# EAGLE design EEZ DIB AUX PS r1B2 (EAGLE 7.2.0)
Assembly variants: Farnell, TME

## Sheet 1 of 2: Power board tester
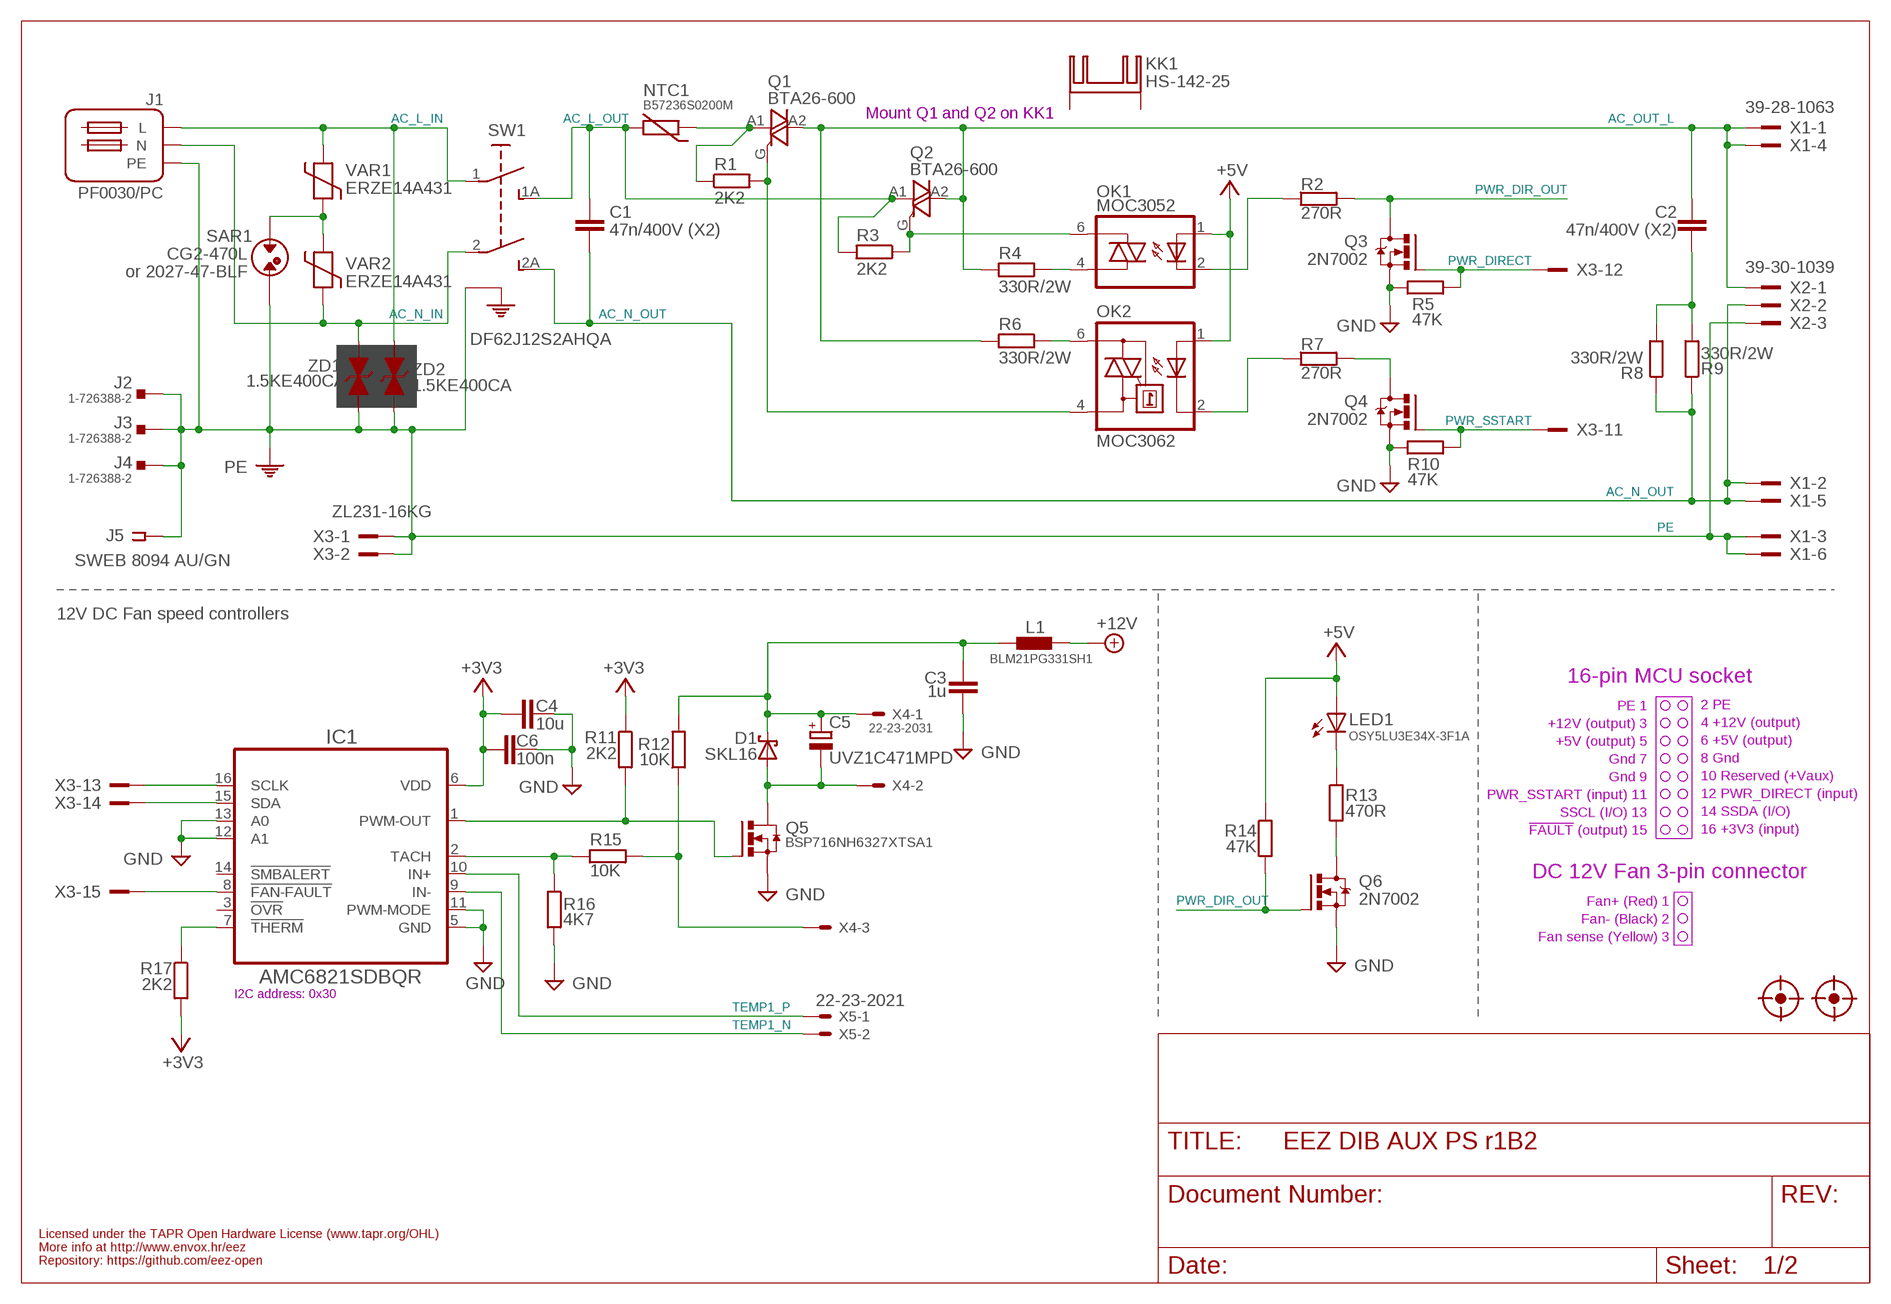
[diagram p0: schematic, sheet 1]

### Parts
C1  47n/400V (X2)  C-EU102-054X133  [C102-054X133]
C2  47n/400V (X2)  C-EU102-054X133  [C102-054X133]
C3  1u  C-EUC0805  [C0805]
C4  10u  C-EUC1206  [C1206]
C5  UVZ1C471MPD  ECAP3.5G_8MM  [ECAP3.5/8]
C6  100n  C-EUC0603  [C0603]
D1  SKL16  SCHOTTKYSOD123  [SOD123]
FM1  FIDUCIAL  [FIDUCIAL]
FM2  FIDUCIAL  [FIDUCIAL]
IC1  AMC6821SDBQR  AMC6821  [DBQ16]
J1  PF0030/PC  [PF0030/PC]
J2  1-726388-2  PCB_TAB4.8MM  [PCB_TAB-4.8MM]
J3  1-726388-2  PCB_TAB4.8MM  [PCB_TAB-4.8MM]
J4  1-726388-2  PCB_TAB4.8MM  [PCB_TAB-4.8MM]
J5  SWEB 8094 AU/GN  BINDING_POSTCLIFF  [S16N-PC]
KK1  HS-142-25  SK129-PAD  [SK129]
L1  BLM21PG331SH1  L-EU0805  [0805]
LED1  OSY5LU3E34X-3F1A  LEDOSG8  [OSG8]
NTC1  B57236S0200M  NTC11.5X6  [NTC_11.5X6_RM5]
OK1  MOC3052  MOC305X  [DIL6-SMD]
OK2  MOC3062  MOC3033S  [DIL6-SMD]
Q1  BTA26-600  BTA26-V  [TOP3S-1]
Q2  BTA26-600  BTA26-V  [TOP3S-1]
Q3  2N7002  [SOT103P240X110-3N]
Q4  2N7002  [SOT103P240X110-3N]
Q5  BSP716NH6327XTSA1  N-HEXFET-2D_SOT232-IRLL014N  [SOT223]
Q6  2N7002  [SOT103P240X110-3N]
R1  2K2  R-EU_R0805  [R0805]
R2  270R  R-EU_R0805  [R0805]
R3  2K2  R-EU_R0805  [R0805]
R4  330R/2W  R-EU_R2512  [R2512]
R5  47K  R-EU_R0805  [R0805]
R6  330R/2W  R-EU_R2512  [R2512]
R7  270R  R-EU_R0805  [R0805]
R8  330R/2W  R-EU_R2512  [R2512]
R9  330R/2W  R-EU_R2512  [R2512]
R10  47K  R-EU_R0805  [R0805]
R11  2K2  R-EU_R0805  [R0805]
R12  10K  R-EU_R0805  [R0805]
R13  470R  R-EU_R0805  [R0805]
R14  47K  R-EU_R0805  [R0805]
R15  10K  R-EU_R0805  [R0805]
R16  4K7  R-EU_R0805  [R0805]
R17  2K2  R-EU_R0805  [R0805]
SAR1  CG2-470L  SAR  [SAR]
SW1  DF62J12S2AHQA  [DF62J12S2]
VAR1  ERZE14A431  VARISTOR-13  [VARISTOR_13MM]
VAR2  ERZE14A431  VARISTOR-13  [VARISTOR_13MM]
X1  39-28-1063  MINIFIT_5566-06A-CRE  [MINIFIT_5566-06A_CRE]
X2  39-30-1039  MINIFIT_39301039-CREEPAGE  [MINIFIT_39301039_CRE]
X3  ZL231-16KG  IDC-16PIN-ANGLED  [ML16L]
X4  22-23-2031  [22-23-2031]
X5  22-23-2021  [22-23-2021]
ZD1  1.5KE400CA  1.5KE-BIDIR  [DO201-BIDIR]
ZD2  1.5KE400CA  1.5KE-BIDIR  [DO201-BIDIR]

### Nets
+3V3: C4.2 C6.2 IC1.6(VDD) R11.1 R17.2 ; also sheet 2
+5V: LED1.A OK1.1(A) OK2.1(A) R14.1 ; also sheet 2
+12V: L1.2 ; also sheet 2
+12V_FAN: C3.1 C5.+ D1.C L1.1 R12.2 X4.1
AC_L_IN: J1.L SW1.1(P) VAR1.2 ZD2.A
AC_L_OUT: C1.1 NTC1.1 Q2.A1 R3.2 SW1.1A(S) ; also sheet 2
AC_N_IN: J1.N SW1.2(P1) VAR2.1 ZD1.A
AC_N_OUT: C1.2 R8.1 R9.1 SW1.2A(S1) X1.2 X1.5 X2.2 ; also sheet 2
AC_OUT_L: C2.1 Q1.A2 Q2.A2 R4.2 R6.2 X1.1 X1.4 X2.1
FAN_OUT: C5.- D1.A Q5.2(D) Q5.4(D) X4.2
FAN_SENSE: R12.1 R15.2 X4.3
GND [gnd]: C3.2 C4.1 C6.1 IC1.5(GND) IC1.11(PWM-MODE) IC1.12(A1) IC1.13(A0) Q3.2(S) Q4.2(S) Q5.3(S) Q6.2(S) R5.1 R10.1 R16.2 ; also sheet 2
N$1: NTC1.2 Q1.A1 R1.1
N$2: IC1.2(TACH) R15.1 R16.1
N$3: IC1.7(!THERM) R17.1
N$6: SAR1.P$1 VAR1.1 VAR2.2
N$7: OK2.2(C) R7.1
N$10: OK1.2(C) R2.1
N$13: Q6.3(D) R13.2
N$14: LED1.C R13.1
N$16: Q4.3(D) R7.2
N$58: IC1.1(PWM-OUT) Q5.1(G) R11.2
N$71: OK1.6(A2) Q2.G R3.1
N$72: OK2.4(A1) Q1.G R1.2
N$73: OK2.6(A2) R6.1
N$76: OK1.4(A1) R4.1
N$83: C2.2 R8.2 R9.2
NFAULT: IC1.8(!FAN-FAULT) X3.15
PE: J1.PE J2.P$1 J2.P$2 J3.P$1 J3.P$2 J4.P$1 J4.P$2 J5.1 J5.NC1 J5.NC2 J5.NC3 J5.NC4 SAR1.P$2 SW1.PE1(PE) SW1.PE2(PE) X1.3 X1.6 X2.3 X3.1 X3.2 ZD1.C ZD2.C ; also sheet 2
PWR_DIR_OUT: Q3.3(D) Q6.1(G) R2.2 R14.2
PWR_DIRECT: Q3.1(G) R5.2 X3.12
PWR_SSTART: Q4.1(G) R10.2 X3.11
SSCL: IC1.16(SCLK) X3.13
SSDA: IC1.15(SDA) X3.14
TEMP1_N [diff]: IC1.9(IN-) X5.2
TEMP1_P [diff]: IC1.10(IN+) X5.1
Unconnected: IC1.3(!OVR) IC1.14(!SMBALERT) KK1.A2,5(K) KK1.B2,5(K) X3.10

### Notes on the sheet
- Mount Q1 and Q2 on KK1
- or 2027-47-BLF
- 12V DC Fan speed controllers
- 16-pin MCU socket
- PE 1
- 2 PE
- +12V (output) 3
- 4 +12V (output)
- +5V (output) 5
- 6 +5V (output)
- Gnd 7
- 8 Gnd
- Gnd 9
- 10 Reserved (+Vaux)
- PWR_SSTART (input) 11
- 12 PWR_DIRECT (input)
- SSCL (I/O) 13
- 14 SSDA (I/O)
- !FAULT! (output) 15
- 16 +3V3 (input)
- DC 12V Fan 3-pin connector
- Fan+ (Red) 1
- Fan- (Black) 2
- Fan sense (Yellow) 3
- I2C address: 0x30
- Licensed under the TAPR Open Hardware License (www.tapr.org/OHL)
- More info at http://www.envox.hr/eez
- Repository: https://github.com/eez-open

## Sheet 2 of 2
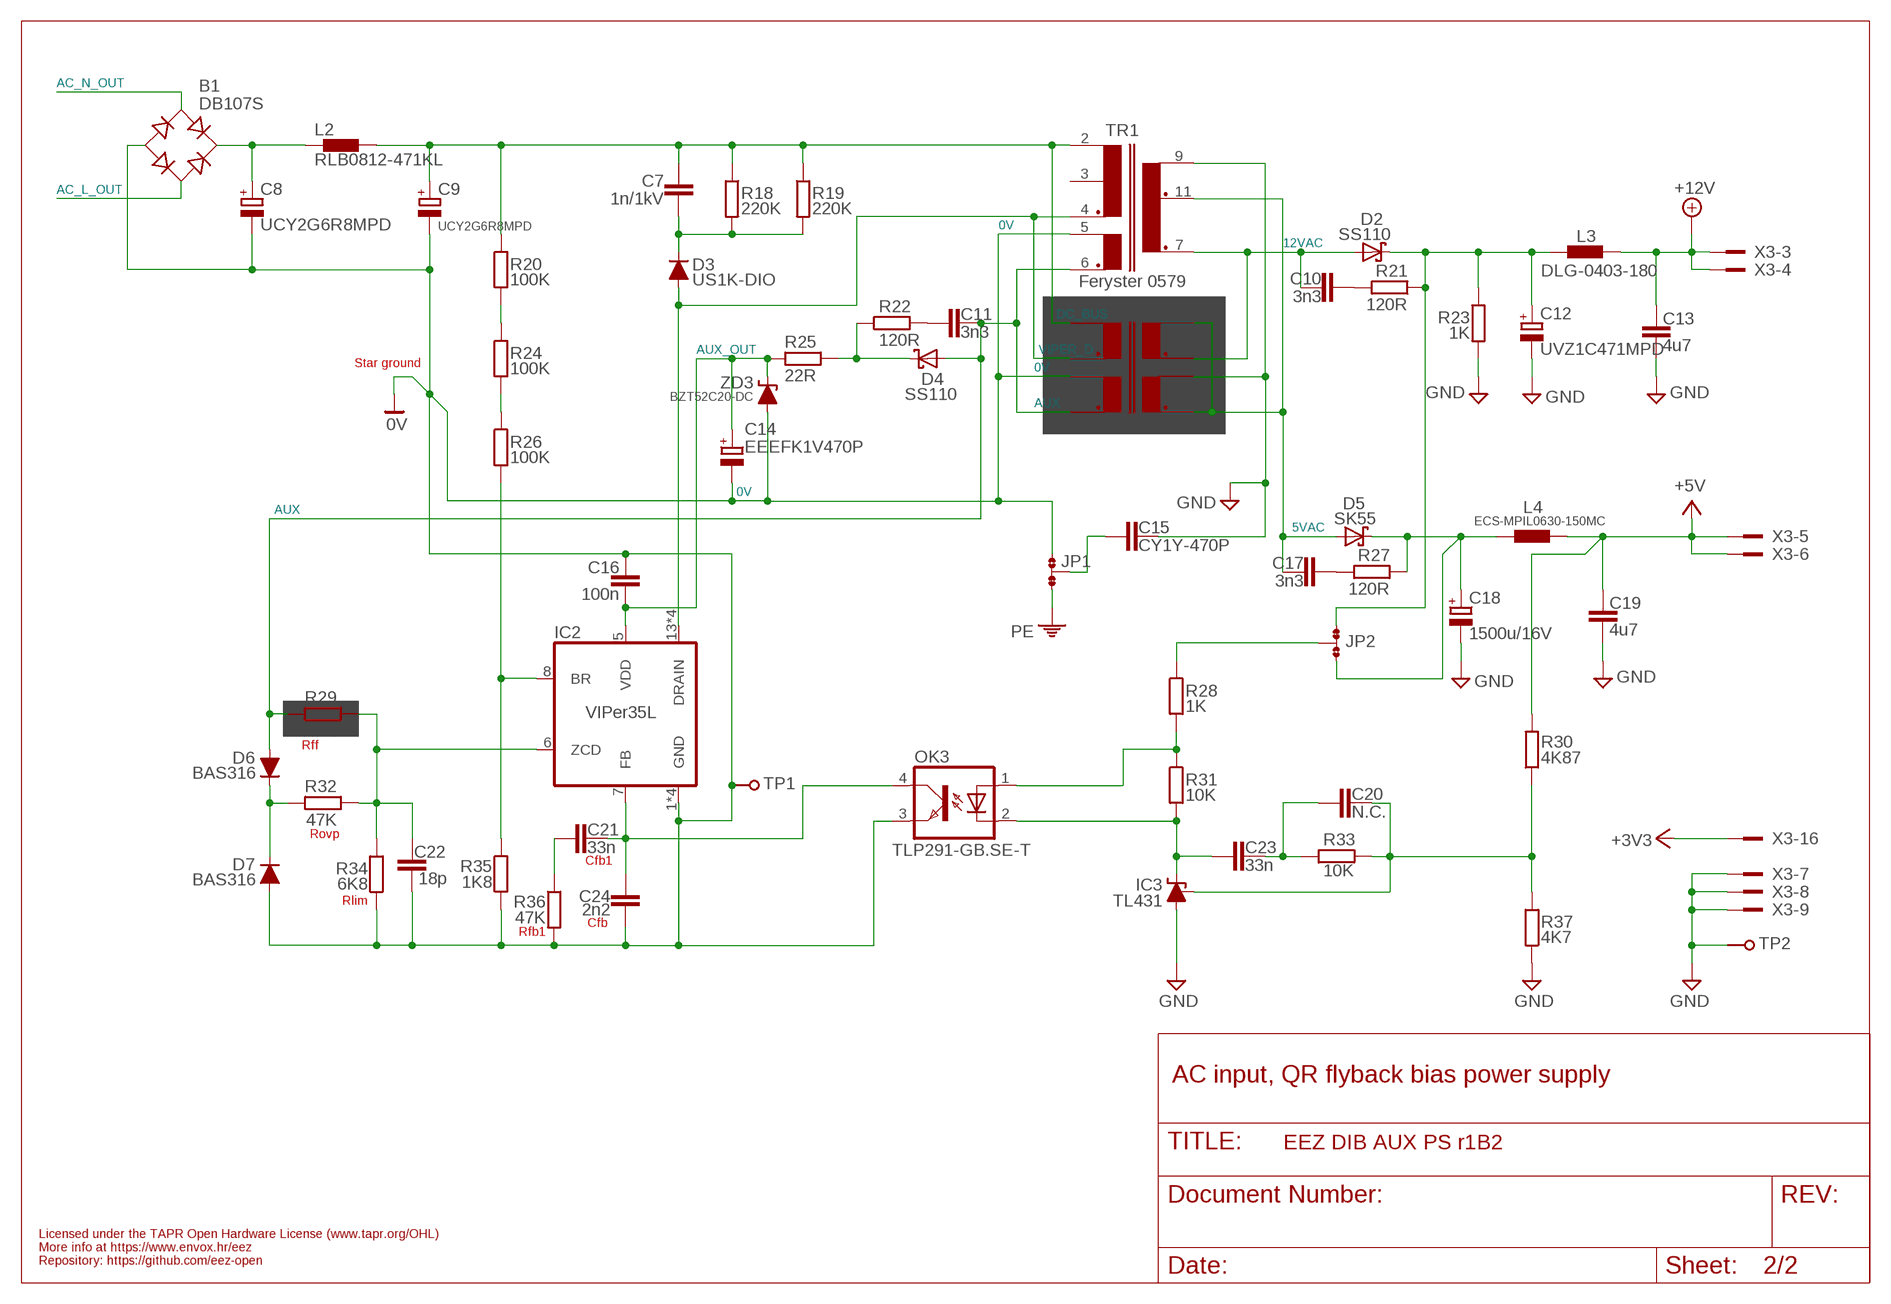
[diagram p1: schematic, sheet 2]

### Parts
B1  DB107S  DBS107G  [DBS]
C7  1n/1kV  C-EUC1210  [C1210]
C8  UCY2G6R8MPD  ECAP5G_10.5MM  [ECAP5/10.5]
C9  UCY2G6R8MPD  ECAP5G_10.5MM  [ECAP5/10.5]
C10  3n3  C-EUC0805  [C0805]
C11  3n3  C-EUC0805  [C0805]
C12  UVZ1C471MPD  ECAP3.5G_8MM  [ECAP3.5/8]
C13  4u7  C-EUC1210  [C1210]
C14  EEEFK1V470P  ECAPPANASONIC_H  [CAPAE660X610N]
C15  CY1Y-470P  C-EUCY  [CY075-032X103]
C16  100n  C-EUC0603  [C0603]
C17  3n3  C-EUC0805  [C0805]
C18  1500u/16V  ECAP5G_13MM  [ECAP5/13]
C19  4u7  C-EUC1210  [C1210]
C20  N.C.  C-EUC0805  [C0805]
C21  33n  C-EUC0805  [C0805]
C22  18p  C-EUC0603  [C0603]
C23  33n  C-EUC0805  [C0805]
C24  2n2  C-EUC0805  [C0805]
D2  SS110  SCHOTTKYSMB  [SMB]
D3  US1K-DIO  DIODEDO214AA  [DO214AA]
D4  SS110  SCHOTTKYSMB  [SMB]
D5  SK55  SCHOTTKYSMB  [SMB]
D6  BAS316  DIODESOD323R  [SOD323-R]
D7  BAS316  DIODESOD323R  [SOD323-R]
IC2  VIPer35L  VIPER35  [SOIC-16]
IC3  TL431  [SOT103P240X110-3N]
JP1  JP3-CUT  [JP3-CUT]
JP2  JP3-CUT  [JP3-CUT]
L2  RLB0812-471KL  FERYSTER_DSZ6  [FERSYTER_DSZ6]
L3  DLG-0403-180  DE0403  [DE0403]
L4  ECS-MPIL0630-150MC  DE0704  [DE0704]
OK3  TLP291-GB.SE-T  TLP291  [SO4]
R18  220K  R-EU_R1206  [R1206]
R19  220K  R-EU_R1206  [R1206]
R20  100K  R-EU_R1206  [R1206]
R21  120R  R-EU_R0805  [R0805]
R22  120R  R-EU_R0805  [R0805]
R23  1K  R-EU_R0805  [R0805]
R24  100K  R-EU_R1206  [R1206]
R25  22R  R-EU_R0805  [R0805]
R26  100K  R-EU_R1206  [R1206]
R27  120R  R-EU_R0805  [R0805]
R28  1K  R-EU_R0805  [R0805]
R29  N.C.  R-EU_R0805  [R0805]
R30  4K87  R-EU_R0805  [R0805]
R31  10K  R-EU_R0805  [R0805]
R32  47K  R-EU_R0805  [R0805]
R33  10K  R-EU_R0805  [R0805]
R34  6K8  R-EU_R0805  [R0805]
R35  1K8  R-EU_R0805  [R0805]
R36  47K  R-EU_R0805  [R0805]
R37  4K7  R-EU_R0805  [R0805]
TP1  PCB_TEST_TABSHIELD  [PCB_SHIELD_TAB]
TP2  PCB_TEST_TABSHIELD  [PCB_SHIELD_TAB]
TR1  Feryster 0579  FERYSTER_0579  [FERYSTER_0579]
TR1B  (WE 760875532)  WE-UOST  [WE-UOST]
ZD3  BZT52C20-DC  ZENER-DIODESOD123  [SOD123]

### Nets
0V: B1.- C8.- C9.- C14.2(-) C16.1 C22.2 C24.2 D7.A IC2.1(GND) IC2.2(GND) IC2.3(GND) IC2.4(GND) JP1.NO OK3.3(EMIT) R34.1 R35.2 R36.2 TP1.1 TR1.5(AUX) TR1B.11(AUX) ZD3.A
5VAC: C17.2 D5.A TR1.11(S1_DOT) TR1B.2(S1) TR1B.3(S2_DOT) TR1B.4(S2_DOT)
12VAC: C10.2 D2.A TR1.7(S2_DOT) TR1B.1(S1_DOT)
+3V3: X3.16 ; also sheet 1
+5V: C19.1 L4.2 R30.2 X3.5 X3.6 ; also sheet 1
+5V_REC: C18.+ D5.C JP2.NO L4.1 R27.1
+12V: C13.1 L3.2 X3.3 X3.4 ; also sheet 1
+12V_REC: C12.+ D2.C JP2.NC L3.1 R21.1 R23.1
AC_L_OUT: B1.AC2 ; also sheet 1
AC_N_OUT: B1.AC1 ; also sheet 1
AUX: C11.2 D4.A D6.A R29.2 TR1.6(AUX_DOT) TR1B.12(AUX_DOT)
AUX_OUT: C14.1(+) C16.2 IC2.5(VDD) R25.2 ZD3.C
AUX_REC: D4.C R22.1 R25.1
DC_BUS: C7.1 C9.+ L2.P$2 R18.1 R19.1 R20.1 TR1.2(P1) TR1B.7(P1)
FB1: C23.1 IC3.1(C) OK3.2(C) R31.2
GND [gnd]: C12.- C13.2 C15.2 C18.- C19.2 IC3.3(A) R23.2 R37.1 TP2.1 TR1.9(S_COMM) TR1B.5(S2) TR1B.6(S2) X3.7 X3.8 X3.9 ; also sheet 1
N$4: C15.1 JP1.COM
N$5: OK3.1(A) R28.2 R31.1
N$8: C10.1 R21.2
N$9: B1.+ C8.+ L2.P$1
N$11: R24.2 R26.1
N$12: JP2.COM R28.1
N$20: IC2.8(BR) R26.2 R35.1
N$49: R20.2 R24.1
N$137: C7.2 D3.C R18.2 R19.2
N$138: C21.2 C24.1 IC2.7(FB) OK3.4(COL)
N$140: C11.1 R22.2
N$141: C22.1 IC2.6(ZCD) R29.1 R32.1 R34.2
N$146: C17.1 R27.2
N$148: C20.2 IC3.2(REF) R30.1 R33.2 R37.2
N$149: C20.1 C23.2 R33.1
N$152: C21.1 R36.1
N$155: D6.C D7.C R32.2
PE: JP1.NC ; also sheet 1
VIPER_D: D3.A IC2.13(DRAIN) IC2.14(DRAIN) IC2.15(DRAIN) IC2.16(DRAIN) TR1.4(P1_DOT) TR1B.9(P1_DOT)
Unconnected: TR1.3(P1_MIDDLE)

### Notes on the sheet
- Star ground
- Rff
- Rovp
- Cfb1
- Rlim
- Cfb
- Rfb1
- AC input, QR flyback bias power supply
- Licensed under the TAPR Open Hardware License (www.tapr.org/OHL)
- More info at https://www.envox.hr/eez
- Repository: https://github.com/eez-open

## Library data of the parts
B1 = rectifier:DB?*G: Single Phase 1.0 AMP Glass Passivated Bridge Rectifier Taiwan Semiconductor Co.,Ltd. - TSC Source: http://www.taiwansemi.com/TSCbig5/ezcatfiles/cust/img/img/db101g.pdf http://www.ts.com.tw/db/pictures/modules/PDT/PDT060207001/DBLS201G.pdf
C1-C4 C6 C7 C10 C11 C13 C16 C17 C19-C24 = rcl:C-EU: CAPACITOR, European symbol
C5 C8 C9 C12 C14 C18 = EEZ_Lib1:ECAP
C15 = EEZ_Lib1:C-EU
D1 D2 D4 D5 = EEZ_Lib1:SCHOTTKY
D3 D6 D7 = EEZ_Lib1:DIODE
FM1 FM2 = EEZ_Lib1:FIDUCIAL: Fiducial mark for pick and place automation
IC1 = EEZ_DIB:AMC6821: Intelligent Temperature Monitor and PWM Fan Controller, I2C; DATASHEETURL: httpwww.ti.comlitgpnAMC6821; FAMILY_NAME: TEMP MONITORING AND FAN CONTROL; GENERIC_PART_NUMBER: AMC6821; INDUSTRY_STD_PKG_TYPE: SSOPQSOP; MANUFACTURER: Texas Instruments; PACKAGE_DESIGNATOR: DBQ; PIN_COUNT: 16
IC2 = EEZ_Lib1:VIPER35: Quasi-resonant high performance off line high voltage converter, 800 V
IC3 = EEZ_Lib1:TL431: Precision programmable reference
J1 = EEZ_connectors:PF0030/PC: PC Flanged Mount Fused Inlet, twin fused 5 x 20 mm, 250 Vac, 10 A, PC spills
J2-J4 = EEZ_connectors:PCB_TAB
J5 = EEZ_Lib1:BINDING_POST: Various 4 mm binding posts
JP1 JP2 = EEZ_Lib1:JP3-CUT
KK1 = EEZ_DIB:SK129-PAD: Extruded heatsink; SOT32,TO220,TO3P; L:25.4mm; 7.8K/W Compatible model: Stonecold HS-142-25
L1 = EEZ_Lib1:L-EU
L2 = EEZ_Lib1:FERYSTER_DSZ6: Feryster DSZ type choke on RSZ ferrite core
L3 = EEZ_inductors_and_transformers:DE0403: Ferrocore SMD power coil 4.0 x 4.5 mm
L4 = EEZ_inductors_and_transformers:DE0704: Ferrocore SMD power coil 7.3 x 7.3 mm
LED1 = EEZ_Lib1:LED
NTC1 = EEZ_Lib1:NTC
OK1 = EEZ_Lib1:MOC305X: 6-pin DIP Random-phase Optoisolators Triac Drivers (600V Peak)
OK2 = optocoupler:MOC30*: 6-Pin DIP Zero-Cross Optoisolators Triac Driver Output (250/400 Volt Peak) Source: http://www.fairchildsemi.com/ds/MO/MOC3043-M.pdf; MF: FAIRCHILD SEMICONDUCTOR; MPN: MOC3033S-M; OC_FARNELL: unknown; OC_NEWARK: 05C2878
OK3 = EEZ_Lib1:TLP291: Toshiba Photocopler GaAs IRED & Photo-transistor
Q1 Q2 = triac:BTA26: 25A TRIAC Source: http://www.st.com/stonline/products/literature/ds/7470.pdf
Q3 Q4 Q6 = EEZ_Lib1:2N7002: N-CHANNEL ENHANCEMENT MODE FIELD EFFECT TRANSISTOR; MPN: 2N7002-7-F; OC_FARNELL: 1713823; OC_NEWARK: 25R5679; PACKAGE: SOT-23-3; SUPPLIER: DIODES INC.
Q5 = transistor-power:N-HEXFET-2D_?-*: HEXFET® Power MOSFET 2 Drain connects http://www.irf.com/product-info/datasheets/data/irll014n.pdf
R1-R37 = rcl:R-EU_: RESISTOR, European symbol
SAR1 = EEZ_Lib1:SAR: EPCOS surge arrester EF470X Farnell: 1886596
SW1 = EEZ_switches:DF62J12S2: Rocker switch SPST; Positions:2; OFF-ON; 16A/250VAC; 6A/48VDC
TP1 TP2 = EEZ_Lib1:PCB_TEST_TAB
TR1 = EEZ_inductors_and_transformers:FERYSTER_0579: Flyback transformer, 1.04mH, 35W
TR1B = EEZ_Lib1:WE-UOST: WE-UOST Universal Offline Standard Transformers
VAR1 VAR2 = EEZ_Lib1:VARISTOR: EPCOS - B72220S0251K101 - VARISTOR, 140J, 250VAC Farnell: 1004357
X1 = EEZ_connectors:MINIFIT_5566-06A: Molex Socket; wire-board; male; Mini-Fit Jr; 4.2mm; PIN:6; THT; 9A; tinned
X2 = EEZ_connectors:MINIFIT_39301039: MOLEX socket; wire-board; male; Mini-Fit Jr; 4.2mm; PIN:3; THT; PCB snap
X3 = EEZ_connectors:IDC-16PIN: 16-pin IDC socket
X4 = con-molex:22-23-2031: .100" (2.54mm) Center Header - 3 Pin; MF: MOLEX; MPN: 22-23-2031; OC_FARNELL: 1462950; OC_NEWARK: 30C0862
X5 = con-molex:22-23-2021: .100" (2.54mm) Center Header - 2 Pin; MF: MOLEX; MPN: 22-23-2021; OC_FARNELL: 1462926; OC_NEWARK: 25C3832
ZD1 ZD2 = EEZ_Lib1:1.5KE-BIDIR
ZD3 = EEZ_Lib1:ZENER-DIODE

## Net classes
0 default: width 0.152 mm, drill 0.3 mm, clearance 0.152 mm
1 diff: width 0.254 mm, drill 0.3 mm, clearance 0.254 mm
2 gnd: width 0.152 mm, drill 0.3 mm, clearance 0.152 mm

## Board
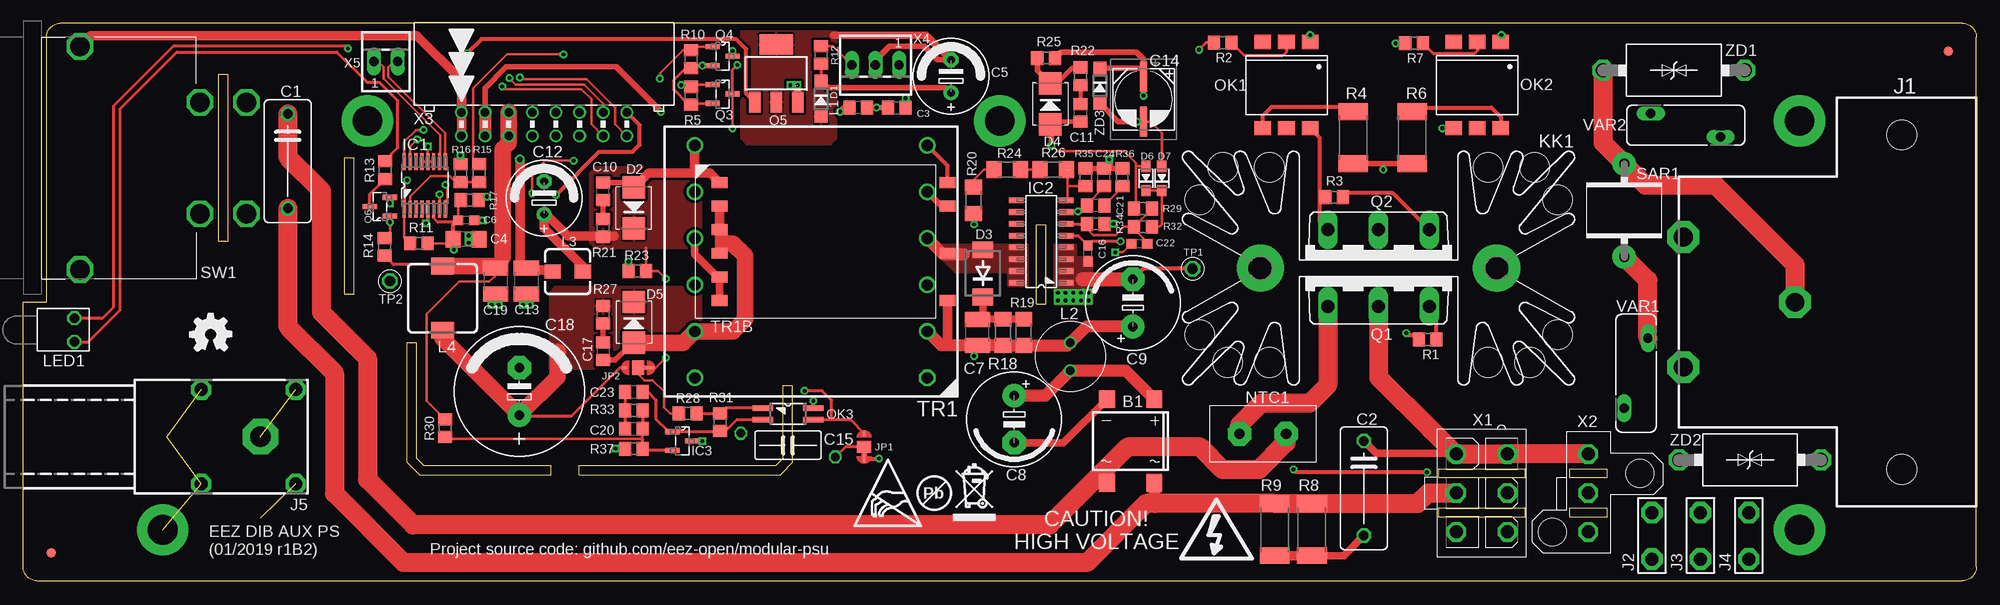
[diagram p2: board, top side]
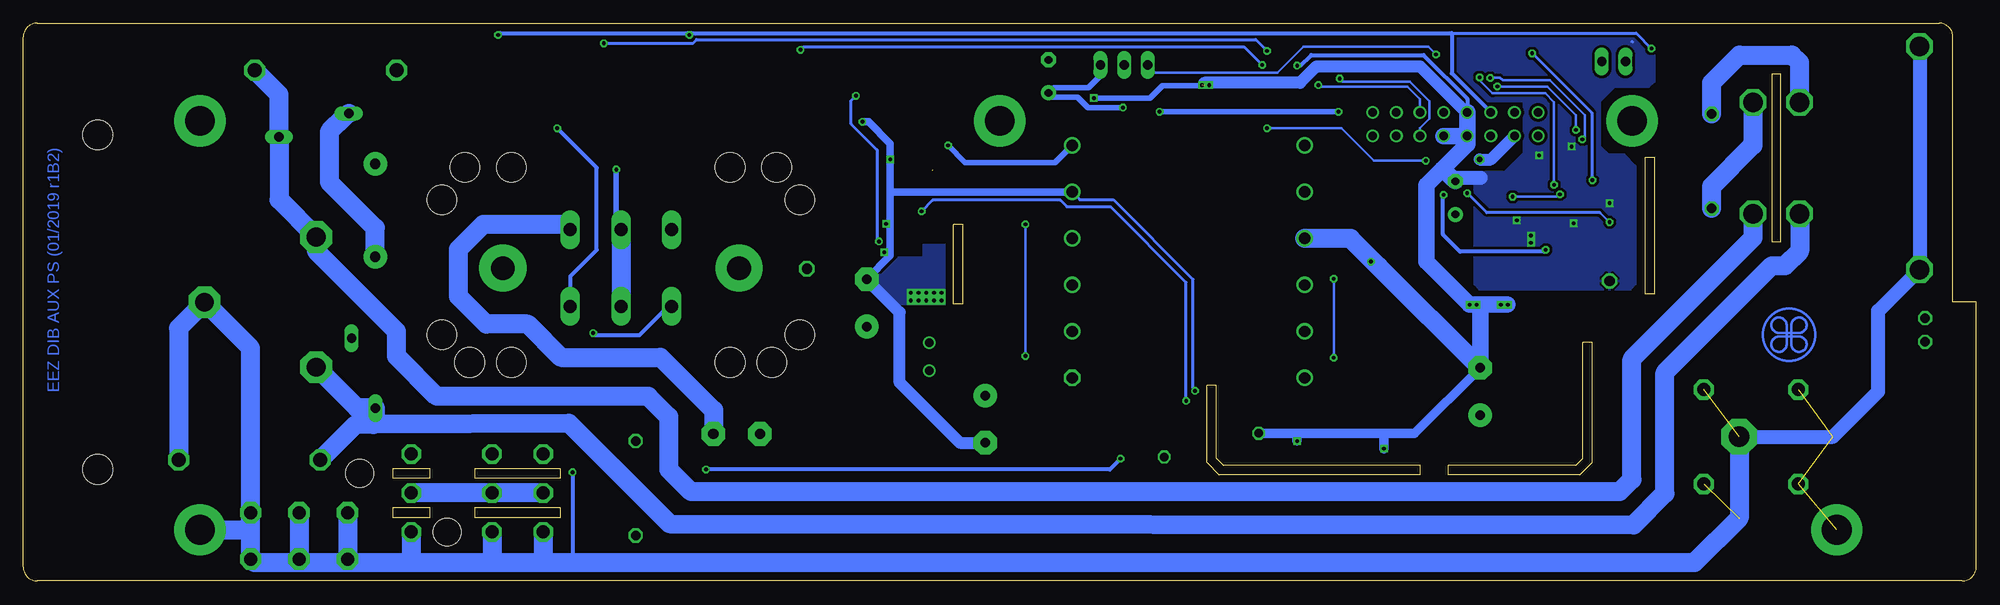
[diagram p3: board, bottom side, seen from below]

Size 210 x 60 mm. Coordinates in mm from the lower left corner, seen from the top.
Outline: 1.5,0 208.5,0 arc90 210,1.5 210,58.5 arc90 208.5,60 4,60 arc90 2.5,58.5 2.5,30 0,30 0,1.5 arc90 1.5,0
Outline: 42.61,11.43 56.77,11.43 56.77,12.45 43.05,12.45 42.29,13.21 42.29,25.65 41.27,25.65 41.27,12.76 42.61,11.43
Outline: 59.75,11.43 81.41,11.43 82.74,12.76 82.74,21.02 81.72,21.02 81.72,13.21 80.96,12.45 59.75,12.45 59.75,11.43
Outline: 108.97,29.78 108.97,38.35 109.98,38.35 109.98,29.78 108.97,29.78
Outline: 34.54,30.86 34.54,45.53 35.56,45.53 35.56,30.86 34.54,30.86
Copper layers (1*16): Top 0.035mm / dielectric 1.5mm / Bottom 0.035mm
Design rules "default *": minimum track width 6mil, minimum drill 0.3mm, track to track 4mil, track to pad 4mil, pad to pad 4mil, via to via 4mil, smd to smd 4mil, copper to edge 30mil, drill to drill 8mil, minimum pad ring 4mil, minimum via ring 8mil, stop-mask expansion 2.5mil, vias tented up to drill 0.6mm, thermal gap 8mil
Holes 3.2 mm at 134,44.5 129,44.5 157.5,44.5 162.5,44.5 134,23.5 129.5,23.5 126.5,26.5 126.5,41 165,41 165,26.5 162,23.5 157.5,23.5

### Footprints (pad centres in the part's own frame; a part is rotated, then mirrored left to right if it is on the bottom)
DBS = smd 1.7 x 1.9: + -2.55,-4.5; - 2.55,-4.5; AC1 -2.55,4.5; AC2 2.55,4.5
C102-054X133 = drill 1.016 octagon: 1 -5.08,0; 2 5.08,0
C0805 = smd 1.3 x 1.5: 1 -0.95,0; 2 0.95,0
C1206 = smd 1.6 x 1.8: 1 -1.4,0; 2 1.4,0
ECAP3.5/8 = drill 0.813 pad 1.6: + -1.778,0 | drill 0.813 pad 1.6 octagon: - 1.778,0
C0603 = smd 1.1 x 1: 1 -0.85,0; 2 0.85,0
C1210 = smd 1.6 x 2.7: 1 -1.4,0; 2 1.4,0
ECAP5/10.5 = drill 1.016 pad 2.54: + -2.54,0 | drill 1.016 pad 2.54 octagon: - 2.54,0
CAPAE660X610N = smd 3.251 x 0.762: 1 -2.413,0; 2 2.413,0
CY075-032X103 = drill 0.914 octagon: 1 -5.08,1.27; 2 5.08,-1.27
ECAP5/13 = drill 1.016 pad 2.54: + -2.54,0 | drill 1.016 pad 2.54 octagon: - 2.54,0
SOD123 = smd 1.4 x 1.4: A 1.9,0; C -1.9,0
SMB = smd 2.4 x 2.4: A 2.2,0; C -2.2,0
DO214AA = smd 1.8 x 2.2: A 2.55,0; C -2.55,0
SOD323-R = smd 1.2 x 1: A 1.3,0; C -1.3,0
FIDUCIAL = smd 1.016 x 1.016: T 0,0
DBQ16 = smd 1.803 x 0.356: 1 -2.553,2.223; 2 -2.553,1.587; 3 -2.553,0.953; 4 -2.553,0.318; 5 -2.553,-0.318; 6 -2.553,-0.953; 7 -2.553,-1.587; 8 -2.553,-2.223; 9 2.553,-2.223; 10 2.553,-1.587; 11 2.553,-0.953; 12 2.553,-0.318; 13 2.553,0.318; 14 2.553,0.953; 15 2.553,1.587; 16 2.553,2.223
SOIC-16 = smd 1.549 x 0.61: 1 -2.692,4.445; 2 -2.692,3.175; 3 -2.692,1.905; 4 -2.692,0.635; 5 -2.692,-0.635; 6 -2.692,-1.905; 7 -2.692,-3.175; 8 -2.692,-4.445; 9 2.692,-4.445; 10 2.692,-3.175; 11 2.692,-1.905; 12 2.692,-0.635; 13 2.692,0.635; 14 2.692,1.905; 15 2.692,3.175; 16 2.692,4.445
SOT103P240X110-3N = smd 1.524 x 0.559: 1 -1.079,1.016; 2 -1.079,-1.016; 3 1.079,0
PF0030/PC = drill 2 pad 3.4 octagon: L -7,31.5; N 7,31.5; PE 0,19.5 | hole 3.2: 18,8; -18,8
PCB_TAB-4.8MM = drill 1.4 pad 2.3 octagon: P$1 -2.54,0; P$2 2.46,0
S16N-PC = drill 2.2 pad 3.81 octagon: 1 0,0 | drill 1.4 pad 2.184 octagon: NC1 -3.8,5.08; NC2 -3.8,-5.08; NC3 6.36,5.08; NC4 6.36,-5.08
JP3-CUT = smd 1.27 x 1.524: COM 0,0 | smd 0.889 x 0.254: NC -1.27,0 | smd 0.508 x 0.254: NO 1.46,0
SK129 = drill 2.54 pad 5.08: A2,5 -12.7,-0.889; B2,5 12.7,-0.889
0805 = smd 1.3 x 1.5: 1 -0.95,0; 2 0.95,0
FERSYTER_DSZ6 = drill 0.9: P$1 -1.5,0; P$2 1.5,0
DE0403 = smd 1.5 x 1.75: 1 0,1.626; 2 0,-1.625
DE0704 = smd 2.5 x 1.8: 1 0,3.45; 2 0,-3.45
OSG8 = drill 1 octagon: A 0,1.27; C 0,-1.27
NTC_11.5X6_RM5 = drill 1.1 pad 2.54 octagon: 1 -2.5,0; 2 2.5,0
DIL6-SMD = smd 1.78 x 1.52: 1 -2.54,-4.645; 2 0,-4.645; 3 2.54,-4.645; 4 2.54,4.645; 5 0,4.645; 6 -2.54,4.645
SO4 = smd 0.6 x 2.2: 1 -0.635,-2.7; 2 0.635,-2.7; 3 0.635,2.7; 4 -0.635,2.7
TOP3S-1 = drill 1.397 long: A1 -5.461,-3.175; A2 0,-3.175; G 5.461,-3.175
SOT223 = smd 1.219 x 2.235: 1 -2.311,-3.099; 2 0,-3.099; 3 2.311,-3.099 | smd 3.6 x 2.2: 4 0,3.099
R0805 = smd 1.3 x 1.5: 1 -0.95,0; 2 0.95,0
R2512 = smd 1.8 x 3.2: 1 -2.8,0; 2 2.8,0
R1206 = smd 1.6 x 1.803: 1 -1.422,0; 2 1.422,0
SAR = drill 1.1 pad 2.54: P$1 0,0; P$2 10,0
DF62J12S2 = drill 2.1 octagon: 1 17,-6; 1A 17,6; 2 22,-6; 2A 22,6; PE1 4.1,-12; PE2 4.1,12
PCB_SHIELD_TAB = drill 1.1 octagon: 1 0,0
FERYSTER_0579 = drill 1.2 octagon: 1 -12.5,12.5 | drill 1.2: 2 -12.5,7.5; 3 -12.5,2.5; 4 -12.5,-2.5; 5 -12.5,-7.5; 6 -12.5,-12.5; 7 12.5,-12.5; 8 12.5,-7.5; 9 12.5,-2.5; 10 12.5,2.5; 11 12.5,7.5; 12 12.5,12.5
WE-UOST = smd 1.7 x 1.17: 1 -12.265,6.35; 2 -12.265,3.81; 3 -12.265,1.27; 4 -12.265,-1.27; 5 -12.265,-3.81; 6 -12.265,-6.35; 7 12.265,-6.35; 9 12.265,-1.27; 11 12.265,3.81; 12 12.265,6.35
VARISTOR_13MM = drill 1.016 long: 1 3.75,-1.27; 2 -3.75,1.27
MINIFIT_5566-06A_CRE = drill 1.4 octagon: 1 -4.2,2.75; 2 0,2.75; 3 4.2,2.75; 4 -4.2,-2.75; 5 0,-2.75; 6 4.2,-2.75
MINIFIT_39301039_CRE = drill 1.4 octagon: 1 0,4.2; 2 0,0; 3 0,-4.2 | hole 3: 5.55,2.1; -3.85,-4.2
ML16L = drill 0.914: 1 -8.89,-1.27; 2 -8.89,1.27; 3 -6.35,-1.27; 4 -6.35,1.27; 5 -3.81,-1.27; 6 -3.81,1.27; 7 -1.27,-1.27; 8 -1.27,1.27; 9 1.27,-1.27; 10 1.27,1.27; 11 3.81,-1.27; 12 3.81,1.27; 13 6.35,-1.27; 14 6.35,1.27; 15 8.89,-1.27; 16 8.89,1.27
22-23-2031 = drill 1 long: 1 -2.54,0; 2 0,0; 3 2.54,0
22-23-2021 = drill 1 long: 1 -1.27,0; 2 1.27,0
DO201-BIDIR = drill 1.499 octagon: A 7.62,0; C -7.62,0

### Placement (x,y rotation side)
B1  119.06,15.05 180 top
C1  28.44,45.16 270 top
C2  144.15,9.97 270 top
C3  93.92,50.93 0 top
C4  47.62,36.77 180 top
C5  99.76,54.29 90 top
C6  47.62,38.8 180 top
C7  102.62,26.73 90 top
C8  106.55,17.4 270 top
C9  119.32,29.91 90 top
C10  62.36,41.91 90 top
C11  113.67,50.36 270 top
C12  56.01,41.21 90 top
C13  54.1,32.26 270 top
C14  120.46,51.82 270 top
C15  82.23,14.61 180 top
C16  114.49,35.24 90 top
C17  62.36,24.7 270 top
C18  53.34,20.38 90 top
C19  50.8,32.26 270 top
C20  65.66,16.38 0 top
C21  115.32,40.39 180 top
C22  120.02,36.26 180 top
C23  65.66,20.32 180 top
C24  116.2,43.43 90 top
D1  85.79,51.88 270 top
D2  65.66,40.13 90 top
D3  103.19,33.08 90 top
D4  110.43,51.31 270 top
D5  65.66,27.81 270 top
D6  120.71,43.31 90 top
D7  122.43,43.31 90 top
EEZ_SIGNATURE  SIGNATURESMALL  [SIGNATURE_5MM]  20.14,26.49 180 top
FM1  3,3 0 top
FM2  207,57 0 top
IC1  43.18,42.56 90 top
IC2  109.47,36.51 180 top
IC3  70.87,15.05 0 top
J1  210,30 90 top
J2  175.13,4.89 90 top
J3  180.34,4.89 90 top
J4  185.55,4.89 90 top
J5  25.5,15.5 180 top
JP1  90.42,14.41 90 top
JP2  66.12,22.93 180 top
KK1  145.73,34.54 0 top
L1  89.79,50.93 180 top
L2  112.59,24.13 90 top
L3  58.55,33.27 270 top
L4  45.09,30.42 180 top
LED1  5.5,27 0 top
NTC1  133.29,15.81 180 top
OK1  135.83,53.34 180 top
OK2  156.34,53.34 180 top
OK3  82.23,17.97 270 top
Q1  145.73,32.7 0 top
Q2  145.73,34.61 180 top
Q3  75.18,52.39 0 top
Q4  75.18,56.45 0 top
Q5  80.96,54.61 0 top
Q6  38.35,40.26 180 top
R1  151,25.97 0 top
R2  128.97,57.91 180 top
R3  140.97,41.27 0 top
R4  143,47.69 270 top
R5  71.82,52.2 90 top
R6  149.35,47.69 270 top
R7  149.54,57.85 180 top
R8  138.56,5.52 270 top
R9  134.56,5.52 270 top
R10  71.82,56.13 90 top
R11  42.55,36.32 180 top
R12  85.79,56.58 270 top
R13  38.93,44.2 270 top
R14  38.86,35.94 90 top
R15  49.02,43.88 90 top
R16  47.05,43.88 90 top
R17  48.01,40.96 180 top
R18  105.35,26.73 90 top
R19  107.57,26.73 90 top
R20  102.17,40.96 90 top
R21  62.36,37.97 90 top
R22  113.67,54.29 270 top
R23  66.04,33.34 180 top
R24  105.79,44.26 0 top
R25  109.98,56.26 0 top
R26  110.74,44.26 0 top
R27  62.36,28.64 270 top
R28  71.44,18.03 0 top
R29  120.4,40.07 180 top
R30  45.37,16.43 90 top
R31  74.93,17.08 270 top
R32  120.4,38.1 0 top
R33  65.66,18.35 0 top
R34  115.32,38.42 180 top
R35  114.24,43.43 90 top
R36  118.17,43.43 90 top
R37  65.66,14.22 0 top
SAR1  172.15,34.86 90 top
SW1  2,45.5 0 top
TP1  125.73,33.59 0 top
TP2  39.43,32.26 0 top
TR1  84.71,34.35 180 top
TR1B  87.12,36.51 0 top
U$2  [PB_SMALL]  97.94,9.43 180 top
U$3  [RECYCLE_BIN1/8]  99.99,6.45 0 top
U$4  [ESD_SYMBOL]  89.41,5.92 0 top
VAR1  173.42,22.35 90 top
VAR2  178.75,49.02 0 top
X1  156.84,9.46 270 top
X2  168.28,9.46 0 top
X3  56.01,49.15 0 top
X4  91.63,55.5 180 top
X5  38.99,55.88 0 top
ZD1  177.48,54.93 0 top
ZD2  185.67,13.02 180 top
ZD3  115.76,53.28 270 top

### Tracks (layer width: path | path; a pad name or v marks a point on that pad's centre or on a via)
0V  (via drill 0.4)
  Top 0.254: R34.1 v117.22,38.42 | v117.41,35.37 118.28,35.37 C22.2 | C14.2 121.22,49.4 122.43,48.2 D7.A | 117.79,44.77 R36.2
  Top 0.305: OK3.3 84.93,17.37 86.93,17.37 | 86.93,17.37 86.93,19.43 85.92,20.45 v84.01,20.45 | 86.93,17.37 88.93,17.37 JP1.NO
  Top 0.406: TP1.1 120.46,33.59 C9.-
  Top 0.61: R35.2 C24.2 116.71,44.38 R36.2 | 120.52,49.4 C14.2 v119.76,49.4 117.73,49.4 ZD3.A | TR1B.11 98.74,40.32 TR1.5
  Top 0.762: v116.78,45.34 116.78,44.45 116.71,44.38
  Top 0.813: C8.- 111.82,14.86 B1.-
  Top 1.524: C9.- 113.92,32.45
  Bottom 0.254: v117.22,38.42 116.78,38.42 | v117.41,35.37 116.78,35.37
  Bottom 0.305: v84.01,20.45 83.95,20.51 84.2,20.77 84.2,32.45 92.77,41.02 96.38,41.02 TR1.5
  Bottom 0.813: 116.78,41.85 116.78,38.42 116.78,35.37 116.78,34.99 C9.- | 116.78,41.85 TR1.5 | 116.78,41.85 v116.78,45.34 116.78,47.05 119.13,49.4 v119.76,49.4
  Bottom 1.27: C9.- 115.76,28.89 115.76,21.34 109.28,14.86 C8.-
  other vias: 111.25,30.99 112.08,30.99 112.9,30.99 113.73,30.99 114.55,30.99 111.25,30.16 112.08,30.16 112.9,30.16 113.73,30.16 114.55,30.16
  pour Top (isolate 0.254, no thermals): 110.43,36.13 113.22,36.13 113.22,34.8 114.94,34.8 114.94,29.78 110.43,29.78
  pour Bottom (isolate 0.254, no thermals): 110.43,36.13 113.22,36.13 113.22,34.8 115.89,34.8 117.79,32.89 118.24,32.89 118.24,31.5 118.11,31.37 116.46,29.78 110.43,29.78
5VAC
  Top 0.254: 75.5,36.32 74.92,36.32 74.86,36.26
  Top 0.61: D5.A 65.64,25.59 64.96,25.59 64.96,25.08 63.63,23.75 C17.2
  Top 1.016: TR1B.2 TR1B.3 74.86,36.26 TR1B.4
  Top 1.778: D5.A 70.97,25.61 TR1.11 76.32,26.85 77.6,28.13 77.6,34.99 76.26,36.32 75.5,36.32 75.44,36.39
12VAC
  Top 0.61: C10.2 65.13,42.86 D2.A
  Top 1.016: 72.33,43.88 67.25,43.88 65.72,42.35 65.68,42.35 D2.A | TR1.7 72.21,44 72.33,43.88 | 72.33,43.88 73.84,43.88 TR1B.1
+3V3  (via drill 0.4)
  Top 0.254: R11.1 45.78,36.32 C4.2 | C6.2 46.77,40.87 R17.2
  Top 0.305: 46.29,36.7 C4.2 | C6.2 46.23,38.38 46.23,38.6 46.23,38.61 44.58,38.61 44.13,39.05 IC1.6
  Top 0.406: v46.29,35.62 46.29,36.7 | C4.2 46.23,38.38 | v57.28,41.53 61.91,46.16 65.53,46.16 66.29,46.93 66.29,49.02 X3.16
  Bottom 0.406: v46.29,35.62 46.48,35.43 55.5,35.43 57.34,37.27 57.34,41.47 v57.28,41.53
+5V  (via drill 0.4)
  Top 0.254: 50.67,33.15 51.05,33.15 | R30.2 43.75,19 43.74,19 43.37,19.37 43.37,28.7 46.86,32.19 50.1,32.19 50.67,32.77 50.67,33.15 | 50.67,33.15 50.67,33.53 C19.1
  Top 0.305: v158.94,58.74 158.94,58.05 OK2.1 | R30.2 45.23,17.38 | 51.35,33.66 51.14,33.87 | L4.2 45.87,34.04 39.82,34.04 R14.1 | LED1.A 8.52,28.27 9.72,29.46 9.72,51.12 16.19,57.59 34.61,57.59 v34.92,57.28
  Top 0.406: OK1.1 v138.37,58.74
  Top 0.61: 51.56,34.8 51.56,34.42 C19.1 51.01,33.87 51.14,33.87
  Top 1.778: L4.2 51.14,33.87 | 51.56,34.8 51.56,46.48 52.2,47.12 X3.5 X3.6
  Bottom 0.305: 56.39,58.93 36.58,58.93 v34.92,57.28
  Bottom 0.406: v158.94,58.74 158.75,58.93 138.56,58.93 v138.37,58.74 138.18,58.93 56.39,58.93 56.39,54.61 X3.6
+5V_REC
  Top 0.305: C18.+ 53.47,17.72 58.93,17.72 64.14,22.93 JP2.NO
  Top 1.778: L4.1 45.09,26.1 C18.+ 57.47,21.97 57.47,24.57 57.53,24.64
  pour Top (isolate 0.305): 57.21,31.62 72.9,31.62 72.9,24.89 63.5,24.89 61.47,22.86 56.64,22.86 56.64,31.05
+12V  (via drill 0.4, 0.6)
  Top 0.305: 53.4,33.15 C13.1
  Top 0.61: X3.4 49.66,53.02 51.94,55.31 63.75,55.31 v68.58,50.48 | L1.2 88.27,50.93 v87.82,50.48
  Top 1.016: v53.4,45.34 53.4,33.66 C13.1 54.1,33.47 56.73,33.47 L3.2
  Top 1.27: X3.4 X3.3
  Bottom 0.61: v68.58,50.48 v87.82,50.48
  Bottom 1.27: v53.4,45.34 52.2,45.34 X3.3
+12V_FAN  (via drill 0.4)
  Top 0.305: R12.2 D1.C
  Top 0.61: C5.+ 99.18,53.09 86.6,53.09 D1.C | L1.1 v91.76,50.93 C3.1
  Bottom 0.61: X4.1 94.17,54.36 95.44,53.09 99.18,53.09 C5.+ 99.31,52.07 96.65,52.07 95.5,50.93 v91.76,50.93
+12V_REC  (via drill 0.4)
  Top 0.254: JP2.NC 68.02,22.93 v69.09,24 | v69.09,32.51 68.26,33.34 R23.1 66.99,35.88
  Top 1.016: 62.36,37.08 58.61,37.08 56.26,39.43 C12.+ 56.01,37.97 60.17,33.81 L3.1 | 62.36,37.08 63.54,37.08 | R21.1 62.36,37.08
  Bottom 0.254: v69.09,24 v69.09,32.51
  pour Top (isolate 0.305): 60.96,43.88 61.53,44.45 72.9,44.45 72.9,35.81 61.53,35.81 60.96,36.39
AC_L_IN
  Bottom 2.032: 172.34,16.83 151.32,16.95 140.53,6.16 36.83,6.03 33.47,9.4 33.47,22.42 21.97,33.91 20.57,33.91 19,35.48 SW1.1 | 172.34,16.83 172.15,17.02 VAR1.2 174.1,18.6 J1.L | 172.34,16.83 174.24,16.83 ZD2.A
AC_L_OUT
  Top 0.406: Q2.A1 147.26,41.72 142.36,41.72 R3.2
  Top 1.27: B1.AC2 116.51,10.8 115.82,11.49
  Top 2.032: C1.1 28.44,45.6 32.07,41.97 32.07,28.89 37.02,23.94 37.02,10.92 41.91,6.03 110.36,6.03 115.82,11.49 118.75,14.41 126.56,14.41 128.97,12 132.91,12 135.79,14.88 NTC1.1
  Bottom 2.032: Q2.A1 151.19,37.85 151.7,38.35 160.53,38.35 163.19,35.69 163.19,30.61 160.21,27.62 155.77,27.62 152.21,24.07 141.48,24.07 135.76,18.35 135.76,15.84 NTC1.1 | SW1.1A 19,55.77 19.81,56.58 25.46,56.58 28.44,53.6 C1.1
AC_N_IN
  Bottom 2.032: ZD1.A 182.5,52.33 VAR2.1 182.5,41 J1.N 178.5,35.5 169.86,26.86 169.86,24.19 165.54,19.88 142.81,19.88 140.59,17.65 140.59,12 138.18,9.59 38.35,9.59 37.02,10.92 37.02,23.88 24,36.9 SW1.2
AC_N_OUT
  Top 1.27: B1.AC1 121.61,8.44 121.73,8.32
  Top 2.032: C1.2 28.44,27.38 33.47,22.35 33.47,9.4 40.89,1.97 114.36,1.97 120.72,8.32 121.73,8.32 R9.1 R8.1 149.93,8.32 151.07,9.46 X1.5
  Bottom 2.032: X1.5 X1.2 X2.2 | SW1.2A 24,46.87 28.44,42.43 C1.2
AC_OUT_L  (via drill 0.4)
  Top 0.61: R4.2 146.24,44.89 | 146.24,44.89 R6.2 | v146.24,44.26 146.24,44.89
  Top 0.813: X1.4 154.04,13.72 145.48,13.72 C2.1
  Top 1.016: 151.26,16.19 151.35,16.29
  Top 2.032: X2.1 X1.1 X1.4 153.98,13.66 151.35,16.29 145.73,21.91 Q1.A2
  Bottom 0.61: Q2.A2 146.24,38.29 v146.24,44.26
  Bottom 2.032: Q2.A2 Q1.A2
AUX  (via drill 0.4)
  Top 0.254: R29.2 119.63,40.07 | 119.63,40.07 119.7,40.01 | v110.55,46.86 111.19,46.23 118.36,46.23 119.63,44.96 119.63,44.64 | 119.63,40.07 119.63,44.64 | D6.A 119.67,44.61 119.63,44.64
  Top 0.406: 110.03,48.58 D4.A 110.49,49.04 | TR1B.12 99.39,44.67 TR1.6
  Top 0.508: C11.2 110.72,49.41 D4.A
  Top 0.61: v110.55,46.86 110.55,48.26 110.49,48.32 110.28,48.32 110.03,48.58
  Bottom 0.406: TR1.6 97.23,46.85
  Bottom 0.61: 97.23,46.85 99.06,45.02 108.71,45.02 v110.55,46.86
AUX_OUT  (via drill 0.4)
  Top 0.305: v120.46,52.2 C14.1 | v117.98,36.51 114.91,36.51 C16.2 113.44,37.15 IC2.5
  Top 0.61: C14.1 120.46,55.12 | 120.46,55.12 120.46,55.63 | 120.46,55.63 120.46,56.13 119.7,56.9 111.57,56.9 R25.2 | 120.39,55.56 120.46,55.63 | ZD3.C 120.4,55.18 120.46,55.12
  Bottom 0.305: v120.46,52.2 120.97,51.69 120.97,49.15 118.17,46.35 118.17,36.7 v117.98,36.51
AUX_REC
  Top 0.508: R22.1 112.84,55.24 111.19,53.59
  Top 0.61: R25.1 109.03,54.9 D4.C 110.51,53.59 111.19,53.59
DC_BUS  (via drill 0.4)
  Top 0.254: 103.02,25.31 103.21,25.31 | C7.1 102.62,24.77 102.23,24.77 v102.23,24.19 | v102.23,38.35 102.23,39.47 R20.1
  Top 1.016: TR1B.7 99.39,25.39 99.69,25.33
  Top 1.27: TR1.2 98.73,25.33 99.69,25.33 C7.1 103.02,25.31 R18.1 R19.1 112.27,25.31 L2.P$2 114.32,27.37 C9.+
  Bottom 0.254: v102.23,38.35 v102.23,24.19
FAN_OUT
  Top 0.61: C5.- 98.3,56.07 96.84,57.53 93.15,57.53 91.63,56.01 X4.2
  Top 0.813: 87.12,58.74 97.09,58.74 C5.-
  pour Top (isolate 0.305): 77.22,60.07 87.38,60.07 87.38,47.56 86.8,46.99 77.79,46.99 77.22,47.56
FAN_SENSE  (via drill 0.4)
  Top 0.254: R15.2 48.39,45.46 48.39,53.02 52.01,56.64 v58.1,56.64 | X4.3 87.06,57.53 R12.1
  Bottom 0.254: v58.1,56.64 58.93,57.47 72.33,57.47 75.12,54.67 88.27,54.67 X4.3
FB1
  Top 0.305: OK3.2 76.71,17.34 75.5,16.13 R31.2 74.86,16.07 IC3.1 69.41,16.07 68.07,17.4 68.07,19.43 67.18,20.32 C23.1 66.86,20.32
GND  (via drill 0.4)  (1 unrouted)
  Top 0.254: IC1.11 IC1.12 | IC1.13 IC1.12 | R16.2 46.99,45.21 v46.99,45.78 | C4.1 48.26,36.32 v47.88,36.39 | C6.1 v49.4,38.8 | IC1.12 v43.5,46.73 v43.5,46.74 | Q3.2 71.94,51.37 R5.1
  Top 0.305: v39.43,40.64 Q6.2 | v73.03,15.05 IC3.3 | R37.1 v63.69,14.22 | IC1.5 43.5,38.67 v43.31,38.48 | 51.12,30.41 51.18,30.48 | v50.35,29.72 50.35,30.41 C19.2 51.12,30.54 51.12,30.41 | v51.12,29.72 51.12,30.41 | C13.2 54.48,30.48 v54.48,29.72 v53.72,29.72 | 53.53,30.48 53.5,30.45 | 71.78,55.15 R10.1 | 71.94,51.37 71.44,51.37 69.91,52.9 69.91,53.85 71.5,55.44 72.07,55.44 v73.03,55.44 Q4.2
  Top 0.406: 53.53,30.48 C13.2 | R23.2 v65.09,34.35 | R10.1 72.07,55.44
  Top 0.61: C3.2 v94.87,51.94
  Top 0.813: TR1B.6 TR1B.5 74.68,32.7 72.2,35.18 TR1.9 | v82.49,53.34 v83.25,53.34 83.25,51.54 Q5.3
  Bottom 0.305: 36.96,57.98 37.02,58.04 | 50.42,29.72 v50.35,29.72
  Bottom 0.406: v65.09,34.35 64.58,33.85 64.26,33.85 | v73.03,55.44 72.64,55.44 71.5,56.58 59.44,56.58 54.74,51.88 X3.8
  Bottom 0.61: 83,53.59 83,53.28 87.5,53.28 88.84,51.94 v94.87,51.94
  Bottom 1.016: C15.2 72.96,15.88 | 72.96,15.88 63.56,15.88 | 63.56,15.88 60.39,15.88 C18.- | v63.69,14.22 63.69,15.75 63.56,15.88 | v73.03,15.05 73.03,15.81 72.96,15.88
  Bottom 1.27: 56.07,43.37 C12.- | 83,53.59 72.71,53.59 70.93,55.37 59.82,55.37 54.86,50.42 X3.8
  Bottom 1.524: 56.07,43.37 53.28,43.37
  Bottom 1.778: X3.8 X3.7 | 57.4,44.32 59.12,42.61 59.12,34.35 v54.48,29.72 53.34,29.72 | 57.4,44.32 54.74,46.99 X3.7 | C12.- 56.45,43.37 57.4,44.32 | X3.9 X3.7 | 53.34,29.72 50.42,29.72 | C18.- 53.34,29.72
  Bottom 2.032: C18.- 64.26,33.85 67.27,36.85 TR1.9
  other vias: 47.88,37.15
  pour Bottom (isolate 0.305): 56.39,59.05 56.39,54.67 53.59,51.82 53.4,51.63 48.64,51.63 48.64,46.1 50.74,44.01 53.53,44.01 53.98,43.56 53.98,31.94 53.4,31.37 37.21,31.37 36.64,31.94 36.64,44.64 37.85,45.85 39.5,45.85 40.45,46.8 40.45,51.56 38.86,53.15 35.18,53.15 34.61,53.72 34.61,57.98 35.69,59.05
HOLE_UL  (via drill 3.2 pad 5.5)
  other vias: 37,49.5
HOLE_UM  (via drill 3.2 pad 5.5)
  other vias: 105,49.5
HOLE_UR  (via drill 3.2 pad 5.5)
  other vias: 191,49.5
N$1  (via drill 0.4)
  Top 0.406: v148.72,26.67 148.97,26.42 149.61,26.42 R1.1
  Top 2.032: Q1.A1 140.27,21.08 138.3,19.11 133.1,19.11 130.79,16.8 NTC1.2
  Bottom 0.406: Q1.A1 140.65,29.53 143.76,26.42 148.46,26.42 v148.72,26.67
N$2
  Top 0.254: R15.1 R16.1 | IC1.2 41.59,41.34 43.81,43.56 45.85,43.56 46.48,42.93 R16.1 | R16.1 47.05,42.99
N$3  (via drill 0.4)
  Top 0.254: v44.77,41.59 IC1.7 | R17.1 49.47,40.96 v49.85,41.34
  Bottom 0.254: v49.85,41.34 45.02,41.34 v44.77,41.59
N$4
  Top 0.305: JP1.COM 88.39,14.41 C15.1
N$5
  Top 0.305: OK3.1 75.5,18.61 R31.1 R28.2
N$6
  Top 2.032: VAR1.1 174.69,32.32 SAR1.P$1
  Bottom 2.032: VAR2.2 175.45,49.97 177.1,48.32 177.1,42.93 172.15,37.97 SAR1.P$1
N$7
  Top 0.305: OK2.2 156.34,57.02 156.02,56.71 151.64,56.71 R7.1
N$8
  Top 0.61: C10.1 R21.2
N$9
  Top 1.27: B1.+ 118.53,22.63 L2.P$1 109.89,19.94 C8.+
N$10
  Top 0.305: OK1.2 135.83,56.9 135.45,56.52 131.31,56.52 R2.1
N$11
  Top 0.254: R24.2 R26.1
N$12
  Top 0.254: JP2.COM 66.12,22.27 66.8,21.59 67.69,21.59 68.9,20.38 68.9,18.67 69.53,18.04 70.1,18.04
  Top 0.305: 70.1,18.04 R28.1
N$13
  Top 0.305: 36.9,40.26 Q6.3 37.27,41.59 R13.2
N$14
  Top 0.305: R13.1 38.73,45.08 40.26,46.61 40.26,51.69 38.29,53.66 36.96,53.66 33.72,56.9 16.51,56.9 10.41,50.8 10.41,29.15 7,25.73 LED1.C
N$16  (via drill 0.4)
  Top 0.305: R7.2 v147.57,57.85 | v76.26,57.02 Q4.3
  Bottom 0.305: v147.57,57.85 137.99,57.85 137.6,58.23 77.47,58.23 v76.26,57.02
N$20  (1 unrouted)
  Top 0.254: 112.27,44.19 112.27,42.42 | 112.27,42.42 112.27,41.06 IC2.8 | R35.1 112.33,42.48 112.27,42.42
N$49
  Top 0.254: R20.2 102.17,43.12 103.31,44.26 R24.1
N$58  (via drill 0.4)
  Top 0.254: IC1.1 40.96,36.96 R11.2
  Top 0.305: v41.27,43.12 40.96,42.8 IC1.1
  Top 0.406: 78.74,51.18 78.65,51.27 Q5.1 77.72,52.44 77.72,57.21 76.64,58.29 49.28,58.29 v47.75,56.77
  Bottom 0.305: v47.75,56.77 41.34,50.35 41.34,43.18 v41.27,43.12
N$71
  Top 0.406: OK1.6 139.38,47.68 139.38,41.4 | 139.38,41.4 139.38,38.67 Q2.G | R3.1 139.51,41.27 139.38,41.4
N$72  (via drill 0.4)
  Top 0.406: R1.2 151.95,28.77 Q1.G | OK2.4 v152.6,48.7 v152.59,48.7
  Bottom 0.406: Q1.G 151.19,32.77 148.34,35.62 148.34,44.45 v152.59,48.7
N$73
  Top 0.406: R6.1 148.78,50.8 148.91,50.93 157.86,50.93 158.88,49.91 OK2.6
N$76
  Top 0.406: R4.1 144.08,50.93 144.15,50.99 134.24,50.99 133.29,50.04 OK1.4
N$83
  Top 0.813: R8.2 141.98,2.72 C2.2
  Top 1.016: R9.2 R8.2
N$137
  Top 0.813: D3.C 103.19,28.13 | C7.2 103.19,28.13 | R19.2 R18.2 103.21,28.16 103.19,28.13
N$138  (via drill 0.4)
  Top 0.254: C21.2 114.37,40.13 | C21.2 114.37,40.52 116.2,42.35 C24.1 | C21.2 114.37,39.94 114.36,39.94
  Top 0.305: OK3.4 84.93,19.34 v84.96,19.37 | IC2.7 112.23,39.75 v113.41,39.75 113.6,39.94 114.36,39.94
  Bottom 0.305: v84.96,19.37 84.96,32.13 93.09,40.26 97.79,40.26 98.49,40.96 112.2,40.96 v113.41,39.75
N$140
  Top 0.406: R22.2 C11.1
N$141
  Top 0.254: R29.1 121.35,40 R32.1 | R34.2 114.36,37.85 115,37.21 117.47,37.21 118.36,38.1 R32.1 | C22.1 120.86,36.42 119.45,37.84 R32.1
  Top 0.305: IC2.6 R34.2
N$146
  Top 0.61: R27.2 C17.1
N$148
  Top 0.254: 66.61,15.18 66.48,15.3 45.54,15.3 R30.1
  Top 0.305: IC3.2 66.8,14.03 R37.2 66.61,15.18 C20.2 R33.2 | 45.34,15.45 R30.1
N$149
  Top 0.305: C23.2 R33.1 C20.1
N$152
  Top 0.254: C21.1 116.27,40.45 118.17,42.35 R36.1
N$155
  Top 0.254: D6.C D7.C | 121.79,42.01 D7.C | R32.2 122.17,38.1 122.43,38.35 D7.C
NFAULT  (via drill 0.4)
  Top 0.254: X3.15 63.63,49.15 63.63,50.93 60.58,53.98 53.59,53.98 v53.4,54.17 | v45.4,42.61 45.4,42.55 45.59,42.35 45.59,41.08 45.4,40.89 IC1.8
  Bottom 0.254: v53.4,54.17 53.4,53.85 52.01,52.45 46.35,52.45 45.4,51.5 v45.4,42.61
PE  (via drill 0.4, 3.2 pad 5.5)  (5 unrouted)
  Top 0.406: JP1.NC v92.01,13.14 | v150.94,11.68 136.91,11.68 v136.59,12
  Top 1.016: X3.1 X3.2 47.12,53.85 42.29,58.67 7.27,58.67 SW1.PE2
  Top 2.032: J1.PE 190.5,34.04 181.99,42.55 174.47,42.55 SAR1.P$2 169.86,47.15 ZD1.C
  Bottom 0.406: 150.5,1.97 150.37,2.1 150.94,2.1 v150.94,11.68 | v92.01,13.14 93.15,12 v136.59,12
  Bottom 1.016: 105,2 105.03,1.97
  Bottom 1.524: SW1.PE2 SW1.PE1 10.54,29.06 10.54,20.38 15.43,15.5 J5.1
  Bottom 2.032: 154.09,1.97 150.5,1.97 105.03,1.97 30.29,1.97 25.5,6.76 J5.1 | 154.09,1.97 159.59,1.97 | 159.59,1.97 168.4,1.97 | 168.4,1.97 175.13,1.97 | 175.13,1.97 180.34,1.97 | X2.3 168.28,2.1 168.4,1.97 | 185.55,6.03 J4.P$1 185.17,1.97 180.34,1.97 | 185.55,6.03 J4.P$2 185.55,25.05 J1.PE 193.29,27.21 ZD2.C | 175.13,1.97 J2.P$1 J2.P$2 | 180.34,1.97 J3.P$1 J3.P$2 | v191,5.5 186.08,5.5 185.55,6.03 | X1.6 154.09,1.97 | X1.3 159.59,1.97
  other vias: 15,5.5
PWR_DIR_OUT  (via drill 0.4)
  Top 0.254: v76.26,48.7 Q3.3 | v39.43,38.61 39.43,37.46 R14.2 | v59.18,45.21 56.13,45.21 54.74,43.81 v54.74,41.72
  Top 0.305: Q6.1 v39.43,38.61 | 39.05,37.08 R14.2 | Q3.3 76.26,54.99 v76.77,55.5 | R2.2 127.19,57.91 v126.43,57.15
  Bottom 0.254: 40.45,39.62 v39.43,38.61 | v76.26,48.7 68.26,48.7 64.77,45.21 v59.18,45.21
  Bottom 0.305: 40.45,39.62 52.64,39.62 v54.74,41.72 | v76.77,55.5 78.74,57.47 126.11,57.47 v126.43,57.15
PWR_DIRECT  (via drill 0.4)
  Top 0.254: Q3.1 71.82,53.4 R5.2 | R5.2 71.57,53.15 | R5.2 | 71.63,53.34 v70.74,53.34
  Top 0.305: 71.63,53.34 R5.2
  Bottom 0.254: X3.12 59.82,51.82 61.15,53.15 70.55,53.15 v70.74,53.34
PWR_SSTART  (via drill 0.4)
  Top 0.254: Q4.1 71.82,57.47 R10.2 | R10.2 71.5,57.08 | v68.45,54.04 68.45,54.61 70.93,57.09 R10.2
  Bottom 0.254: X3.11 59.82,48.7 58.8,49.72 58.8,51.63 60.9,53.72 68.14,53.72 v68.45,54.04
SSCL  (via drill 0.4)
  Top 0.254: v43.05,48.51 42.23,48.51 40.96,47.25 IC1.16 | X3.13 61.09,49.15 61.09,51.82 60.01,52.9 51.82,52.9 v51.5,53.21
  Bottom 0.254: v51.5,53.21 51.44,53.15 46.1,53.15 43.05,50.1 v43.05,48.51
SSDA  (via drill 0.4)
  Top 0.254: IC1.15 41.59,46.74 v42.35,47.5 42.1,47.24 | X3.14 62.36,51.37 60.33,53.4 52.96,53.4 v52.26,54.1
  Bottom 0.254: v52.26,54.1 52.2,54.17 51.24,54.17 50.93,53.85 45.85,53.85 42.1,50.1 42.1,47.75 v42.35,47.5
TEMP1_N
  Top 0.254: IC1.9 45.41,45.97 45.34,46.04 45.34,48.17 39.24,54.27 39.24,55.24 39.88,55.88 X5.2
TEMP1_P
  Top 0.254: IC1.10 44.77,45.98 44.83,46.04 44.83,47.96 38.73,54.06 38.73,55.24 38.1,55.88 X5.1
VIPER_D
  Top 0.254: TR1B.9 99.39,35.13 101.16,35.13
  Top 1.27: 101.16,35.13 98.94,35.13 TR1.4
  pour Top (isolate 0.305, no thermals): 98.3,36.13 108.08,36.13 108.08,31.75 105.92,31.75 105.92,32.89 105.6,33.21 100.2,33.21 98.3,35.12

### Text on the board
Bottom: EEZ DIB AUX PS (01/2019 r1B2)
tPlace: EEZ DIB AUX PS / (01/2019 r1B2) | Project source code: github.com/eez-open/modular-psu | CAUTION! / HIGH VOLTAGE